# Altium schematic sheet loom-charging-cart.SchDoc
size 297 x 209 mm
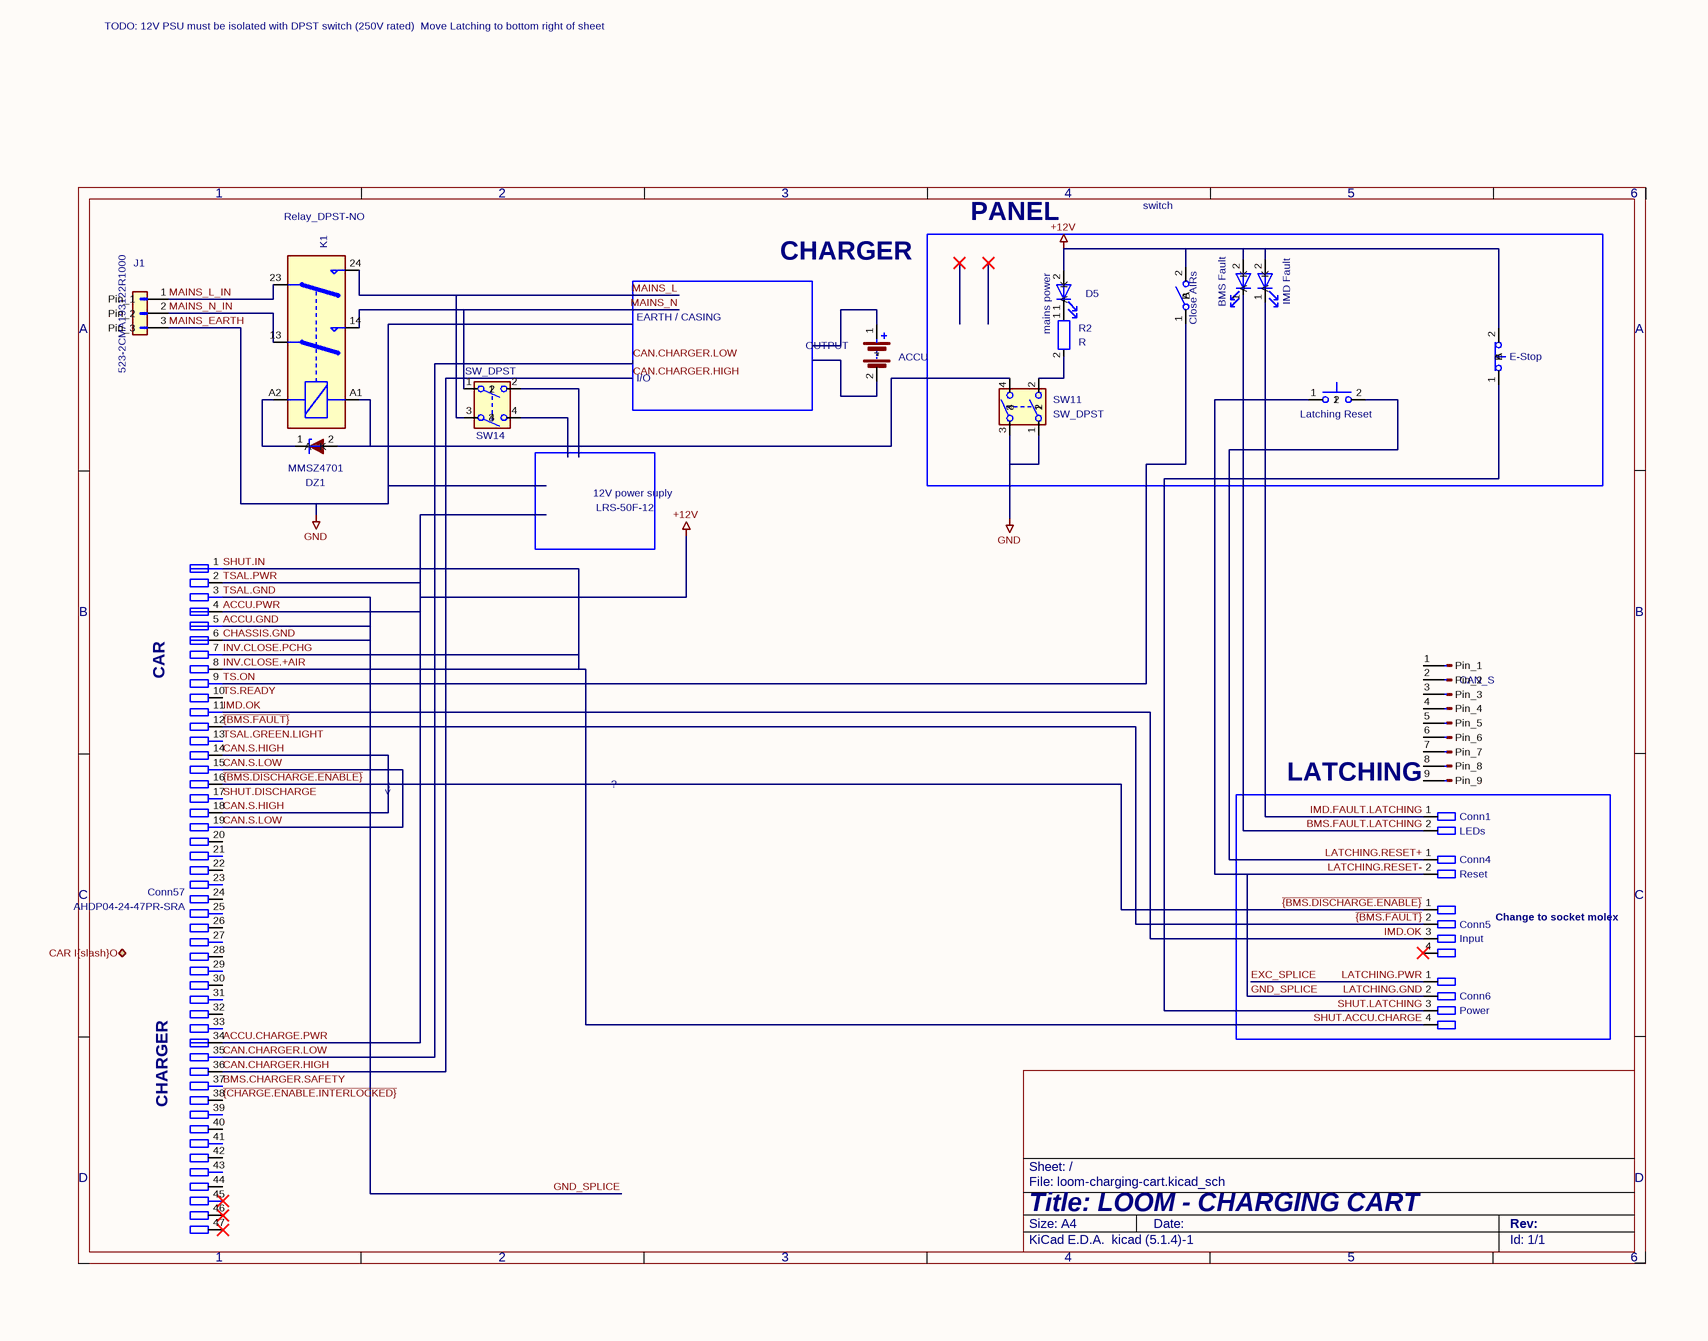
[diagram p0: loom-charging-cart.SchDoc]

## Parts
BT1  ACCU
Conn1  Name: LEDs  (hidden comment: Molex_2x1P_Horizontal_THT)
Conn4  Name: Reset  (hidden comment: Molex_2x1P_Horizontal_THT)
Conn5  Name: Input  (hidden comment: Molex_2x2P_Horizontal)
Conn6  Name: Power  (hidden comment: Molex_2x2P_Horizontal)
Conn57  P/N: AHDP04-24-47PR-SRA  (hidden comment: AMPHENOL-47P-Pannel)
D1  IMD Fault
D2  BMS Fault
D5  mains power
DZ1  MMSZ4701  [D_SOD-123]
J1  523-2CMA193122R1000
J2  CAN_S
K1  Relay_DPST-NO
R2  R
SW1  E-Stop
SW2  Latching Reset
SW3  Close AIRs
SW11  SW_DPST
SW14  SW_DPST

## Blocks framed on the sheet
PANEL: D1 D2 D5 R2 SW1-SW3 SW11
LATCHING: Conn1 Conn4-Conn6

## Ports
CAR I{slash}O (bidir)

## Nets
ACCU.CHARGE.PWR: Conn57.2 Conn57.4 Conn57.34 D1.2(A) D2.2(A) D5.2(A) SW1.2(B) SW3.2(B)  [also labelled +12V, ACCU.PWR, TSAL.PWR]
MAINS_EARTH: J1.3(Pin_3) SW11.1 SW11.3  [also labelled GND]
ACCU.GND: Conn4.2 Conn6.2 Conn57.3 Conn57.5 Conn57.6 SW2.1  [also labelled CHASSIS.GND, GND_SPLICE, LATCHING.GND, LATCHING.RESET-, TSAL.GND]
BMS.CHARGER.SAFETY: Conn57.37
BMS.FAULT.LATCHING: Conn1.2 D2.1(K)
CAN.CHARGER.HIGH: Conn57.36
CAN.CHARGER.LOW: Conn57.35
CAN.S.HIGH: Conn57.14 Conn57.18
CAN.S.LOW: Conn57.15 Conn57.19
EXC_SPLICE: Conn6.1  [also labelled LATCHING.PWR]
IMD.FAULT.LATCHING: Conn1.1 D1.1(K)
IMD.OK: Conn5.3 Conn57.11
INV.CLOSE.+AIR: Conn6.4 Conn57.1 Conn57.7 Conn57.8  [also labelled INV.CLOSE.PCHG, SHUT.ACCU.CHARGE, SHUT.IN]
LATCHING.RESET+: Conn4.1 SW2.2
MAINS_L: K1.24 SW14.3
MAINS_L_IN: J1.1(Pin_1) K1.23
MAINS_N: K1.14 SW14.1
MAINS_N_IN: J1.2(Pin_2) K1.13
SHUT.DISCHARGE: Conn57.17
SHUT.LATCHING: Conn6.3 SW1.1(A)
TS.ON: Conn57.9 SW3.1(A)
TS.READY: Conn57.10
TSAL.GREEN.LIGHT: Conn57.13
~{{BMS.DISCHARGE.ENABLE}}: Conn5.1 Conn57.16
~{{BMS.FAULT}}: Conn5.2 Conn57.12
~{{CHARGE.ENABLE.INTERLOCKED}}: Conn57.38
NetD5_1: D5.1(K) R2.1
NetDZ1_1: DZ1.1(K) K1.A2
NetDZ1_2: DZ1.2(A) K1.A1 SW11.4
NetR2_2: R2.2 SW11.2

Not connected (* = marked no-connect by the designer): BT1 1(+) 2(-); Conn5 4*; Conn57 20 21 22 23 24 25 26 27 28 29 30 31 32 33 39 40 41 42 43 44 45* 46* 47*; J2 1(Pin_1) 2(Pin_2) 3(Pin_3) 4(Pin_4) 5(Pin_5) 6(Pin_6) 7(Pin_7) 8(Pin_8) 9(Pin_9); SW14 2 4

## Notes on the sheet
- TODO:
  12V PSU must be isolated with
  DPST switch (250V rated)
  Move Latching to bottom right
  of sheet
- CHARGER
- switch
- EARTH / CASING
- I/O
- (near BT1) OUTPUT
- 12V power suply
- LRS-50F-12
- (near Conn57) CAR
- <--
- ?
- Change to socket molex
- (near Conn57) CHARGER
- 1
- 2
- 3
- 4
- 5
- 6
- A
- B
- C
- D
- Title: LOOM - CHARGING CART
- File: loom-charging-cart.kicad_sch
- Sheet: /
- KiCad E.D.A.  kicad (5.1.4)-1
- Size: A4
- Date:
- Rev:
- Id: 1/1

## Library data of the parts
BT1 = Battery: Description: Multiple-cell battery; Value: ACCU
Conn1 Conn4 = Molex_2x1P_Horizontal_THT: P/N: 43650-0200; Value: Molex_2x1P_Horizontal_THT
Conn5 Conn6 = Molex_2x2P_Horizontal: P/N: 43045-0400; Value: Molex_2x2P_Horizontal
D1 D2 = LED: Description: Light emitting diode
  D1: Value: IMD Fault
  D2: Value: BMS Fault
D5 = LED_1: Description: Light emitting diode; Sim.Pins: 1=K 2=A; Value: mains power
DZ1 = MMSZ4701: Description: SOD-123 Zener diode, 14V, 500mW, Alternate KiCAD Library; Value: MMSZ4701; Footprint: PCM_Diode_SMD_AKL:D_SOD-123
J1 = Conn_01x03: Description: Generic connector, single row, 01x03, script generated (kicad-library-utils/schlib/autogen/connector/); Value: 523-2CMA193122R1000
J2 = Conn_01x09_Pin: Description: Generic connector, single row, 01x09, script generated; Value: CAN_S
K1 = Relay_DPST-NO: Description: Monostable Relay DPST, Normally Open, EN50005; Value: Relay_DPST-NO
R2 = R: Description: Resistor; Value: R
SW1 = SW_Push_Open: Value: E-Stop
SW2 = SW_Push: Description: Push button switch, generic, two pins; Value: Latching Reset
SW3 = SW_SPST: Description: Single Pole Single Throw (SPST) switch; Value: Close AIRs
SW11 SW14 = SW_DPST: Description: Double Pole Single Throw (DPST) Switch; Value: SW_DPST
Conn57 = AMPHENOL-47P-Pannel: Value: AMPHENOL-47P-Pannel